# Altium schematic sheet 1_P1.schdoc
size 307 x 218 mm; Symbol: Drawing-Symbol_A4; Device: Drawing-Symbol_A4; Company: 嘉立创EDA; Version: V1.0; Page Size: A4; @Project Name: OM5236_TEST; @Page Count: 1; @Update Date: 2025-08-28; @Create Date: 2025-08-27; @Schematic Name: Schematic1; @Page No: 1; @Page Name: P1; @Create Time: 14:43:18; @Update Time: 10:14:23; Width: 1170; Height: 825; Region Start: 1; X Region Count: 6; Y Region Count: 4; Blade Width: 10; Title Block Position: 3; @Board Name: Board1
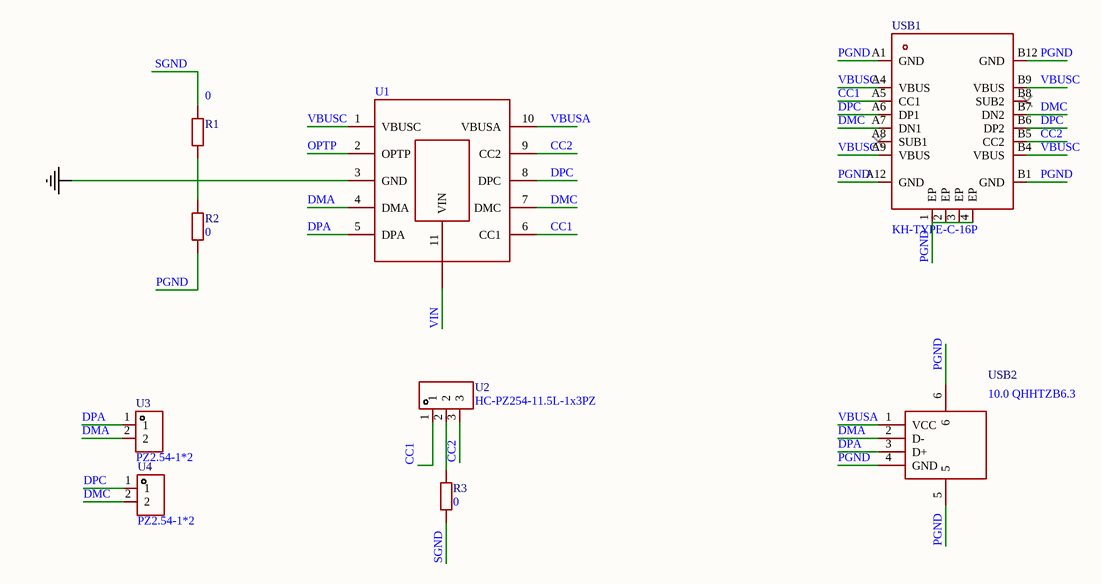
[diagram p0: 1_P1.schdoc]

## Parts
R1  0  [R0603]
R2  0  [R0603]
R3  0  [R0603]
U1  (no value)  [ESSOP-10_L4.9-W3.9-P1.00-LS6.0-BL-EP]
U2  HC-PZ254-11.5L-1x3PZ  [HDR-TH_3P-P2.54-V-M]
U3  PZ2.54-1*2  [HDR-TH_2P-P2.54-V-M-3]
U4  PZ2.54-1*2  [HDR-TH_2P-P2.54-V-M-3]
USB1  KH-TYPE-C-16P  [USB-C-SMD_KH-TYPE-C-16P]
USB2  10.0 QHHTZB6.3  [USB-A-TH_10.0QHHTZB6.3]

## Nets
GND: R1.1 R2.2 U1.3(GND)
CC1: U1.6(CC1) U2.1 USB1.A5(CC1)
CC2: U1.9(CC2) U2.3 USB1.B5(CC2)
DMA: U1.4(DMA) U3.2 USB2.2(D-)
DMC: U1.7(DMC) U4.2 USB1.A7(DN1) USB1.B7(DN2)
DPA: U1.5(DPA) U3.1 USB2.3(D+)
DPC: U1.8(DPC) U4.1 USB1.A6(DP1) USB1.B6(DP2)
OPTP: U1.2(OPTP)
PGND: R2.1 USB1.1(EP) USB1.2(EP) USB1.3(EP) USB1.4(EP) USB1.A1(GND) USB1.A12(GND) USB1.B1(GND) USB1.B12(GND) USB2.4(GND) USB2.5 USB2.6
SGND: R1.2 R3.2
VBUSA: U1.10(VBUSA) USB2.1(VCC)
VBUSC: U1.1(VBUSC) USB1.A4(VBUS) USB1.A9(VBUS) USB1.B4(VBUS) USB1.B9(VBUS)
VIN: U1.11(VIN)
NetR3_1: R3.1 U2.2

Not connected (* = marked no-connect by the designer): USB1 A8(SUB1)* B8(SUB2)*

## Notes on the sheet
- 1
- 2
- 3
- 4
- 5
- 6
- A
- B
- C
- 原理图
- Schematic1
- 创建日期
- 更新日期
- 2025-08-27
- 2025-08-28
- 板子
- 绘制
- Board1
- 图页
- P1
- D
- 审阅
- 版本
- 尺寸
- OM5236_TEST
- 页    1    共    1
- V1.0
- A4
- 嘉立创EDA

## Library data of the parts
R1-R3 = R0603: Manufacturer: UNI-ROYAL(厚声); Symbol: 0603WAF4700T5E; Add into BOM: yes; Tolerance: ±1%; Power(Watts): 100mW; Overload Voltage (Max): 75V; Temperature Coefficient: ±100ppm/℃; Device: R0603; Convert to PCB: yes; Manufacturer Part: 0603WAF4700T5E; Supplier: LCSC; Supplier Part: C23179; LCSC Part Name: 470Ω ±1% 100mW 厚膜电阻; Supplier Footprint: 0603; JLCPCB Part Class: Basic Part; Datasheet: https://atta.szlcsc.com/upload/public/pdf/source/20200306/C422600_1E6D84923E4A46A82E41ADD87F860B5C.pdf; Type: 厚膜电阻; Operating Temperature Range: -55℃~+155℃
U1 = OM5236: Symbol: ESSOP10; Add into BOM: yes; Device: OM5236; Convert to PCB: yes
U2 = HC-PZ254-11.5L-1x3PZ: Manufacturer: HC(虹成电子); Add into BOM: yes; Pin Structure: 1x3P; Pitch: 2.54mm; Circluar Pins/Square Pins: 方针; Current Rating: 3A; Symbol: HC-PZ254-11.5L-1X3PZ; Device: HC-PZ254-11.5L-1x3PZ; Convert to PCB: yes; Manufacturer Part: HC-PZ254-11.5L-1x3PZ; Supplier: LCSC; Supplier Part: C27985188; LCSC Part Name: 1x3P 间距:2.54mm 方针 直插; Supplier Footprint: 插件,P=2.54mm; JLCPCB Part Class: Extended Part; Datasheet: https://item.szlcsc.com/datasheet/HC-PZ254-11.5L-1x3PZ/29721146.html; Row Spacing: -; Mounting Type: 直插; Number of Rows: 单排; Number of Pins: 3P; Voltage Rating (Max): -; Length of Mating Pin: 6mm; Insulation Height: 2.5mm; Length of End Connection Pin: 3mm; Contact Material: 黄铜; Contact Plating: 金; Operating Temperature: -40℃~+105℃; Color: 黑色
U3 U4 = PZ2.54-1*2: Manufacturer: ZHOURI(洲日); Add into BOM: yes; Symbol: PZ2.54-1*2; Device: PZ2.54-1*2; Convert to PCB: yes; Manufacturer Part: PZ2.54-1*2; Supplier: LCSC; Supplier Part: C5360898; LCSC Part Name: PZ2.54-1*2; Supplier Footprint: 插件,P=2.54mm; JLCPCB Part Class: Extended Part; Datasheet: https://atta.szlcsc.com/upload/public/pdf/source/20250227/F941FC765EF241ABFB2D5D72948A31A5.pdf
USB1 = KH-TYPE-C-16P: Manufacturer: kinghelm(金航标); Add into BOM: yes; Connector Type: Type-C; Gender: 母; Number of Ports: 1; Number of Contacts: 16P; Current Rating - Power (Max): 3A; Symbol: KH-TYPE-C-16P; Device: KH-TYPE-C-16P; LCSC Part Name: Type-C 母 卧贴; Supplier Part: C709357; Manufacturer Part: KH-TYPE-C-16P; Supplier Footprint: SMD; JLCPCB Part Class: Extended Part; Datasheet: https://atta.szlcsc.com/upload/public/pdf/source/20200911/C709357_AA8DCEB38BB20E3035A7ED7AE7667837.pdf; Supplier: LCSC; Convert to PCB: yes; Standard: -; Mounting Style: 卧贴; Operating Temperature Range: -40℃~+85℃
USB2 = 10.0 QHHTZB6.3: Manufacturer: SHOU HAN(首韩); Add into BOM: yes; Connector Type: Type-A; Protocol Standard: USB 2.0; Gender: 母; Number of Contacts: 4P; Number of Ports: 1; Current Rating-Power: 1.5A; Voltage Rating: 30V; Connect-Disconnect Life: 5千次; Detection color: 黑色; Symbol: 10.0 QHHTZB6.3; Device: 10.0 QHHTZB6.3; LCSC Part Name: Type-A 母 卧贴; Supplier Part: C668591; Manufacturer Part: 10.0 QHHTZB6.3; Supplier Footprint: SMD; JLCPCB Part Class: Extended Part; Datasheet: https://item.szlcsc.com/datasheet/10.0%2520QHHTZB6.3/698534.html; Supplier: LCSC; Convert to PCB: yes; Mounting Type: 卧贴; Supplementary Features: -; Center Height: -; Length: 10mm; Operating Temperature: -25℃~+85℃